# EAGLE schematic recco-rig (EAGLE 9.6.1)
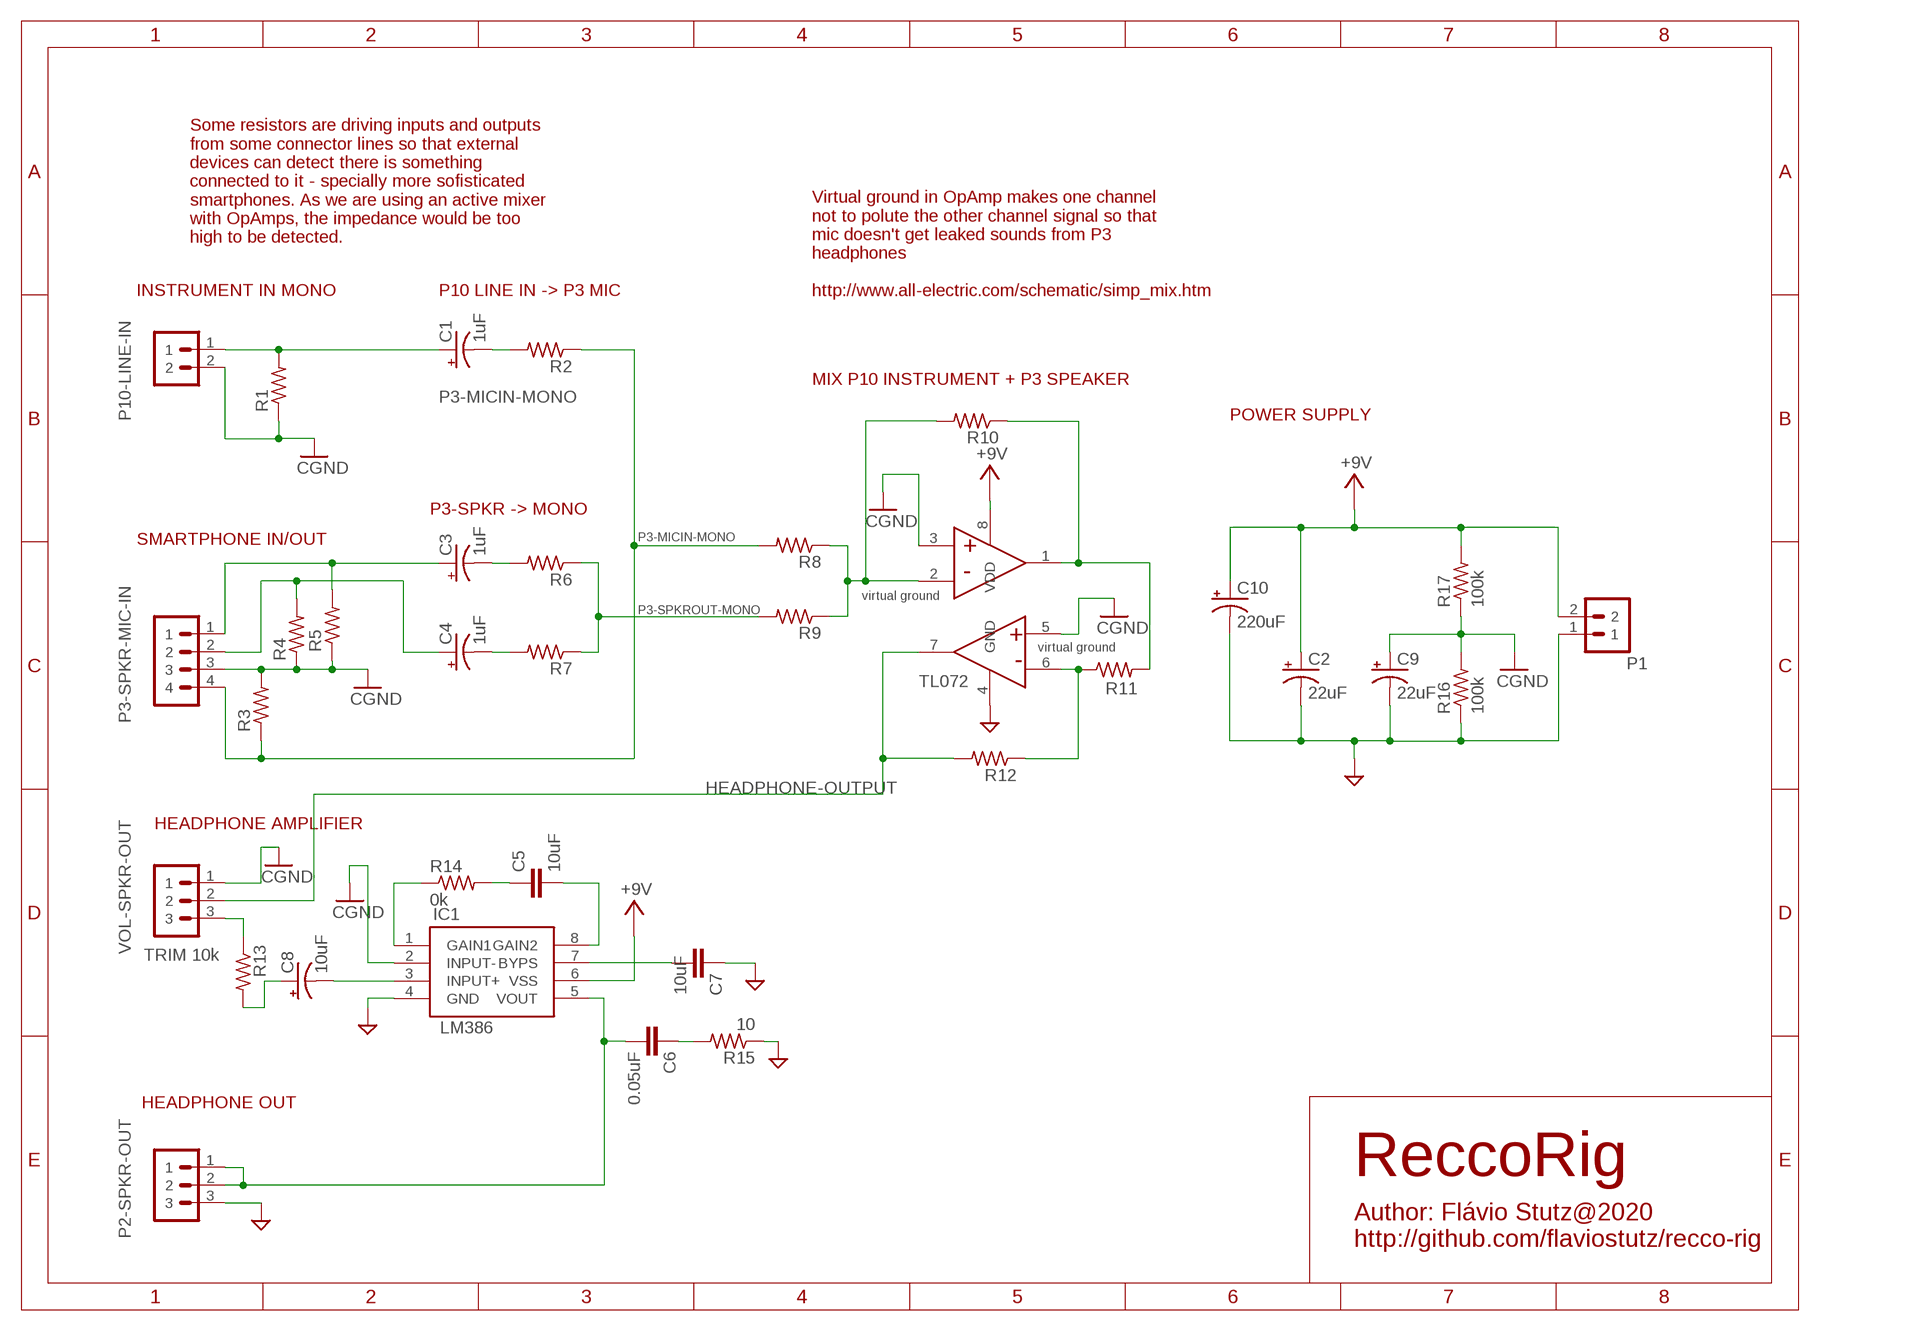
[diagram p0: schematic, sheet 1]

## Parts
C1  1uF  CPOL-USE2,5-6E  [E2,5-6E]
C2  22uF  CPOL-USE2,5-6E  [E2,5-6E]
C3  1uF  CPOL-USE2,5-6E  [E2,5-6E]
C4  1uF  CPOL-USE2,5-6E  [E2,5-6E]
C5  10uF  C-EU050-024X044  [C050-024X044]
C6  0.05uF  C-EU050-024X044  [C050-024X044]
C7  10uF  C-EU050-024X044  [C050-024X044]
C8  10uF  CPOL-USE2,5-6E  [E2,5-6E]
C9  22uF  CPOL-USE2,5-6E  [E2,5-6E]
C10  220uF  CPOL-USE2,5-6E  [E2,5-6E]
IC1  LM386  [PDIP-8PIN]
IC2  TL072-OPAMP  [PDIP-8PIN]
P1  PIN-HEADER-2PIN  [PIN-HEADER-2PIN]
P2-SPKR-OUT  PIN-HEADER-3PIN  [PIN-HEADER-3PIN]
P3-SPKR-MIC-IN  PIN-HEADER-4PIN  [PIN-HEADER-4PIN]
P10-LINE-IN  PIN-HEADER-2PIN  [PIN-HEADER-2PIN]
R1  10k  RESISTORV1  [RESISTOR-V1]
R2  300ohm  RESISTORV1  [RESISTOR-V1]
R3  1k  RESISTORV1  [RESISTOR-V1]
R4  1k  RESISTORV1  [RESISTOR-V1]
R5  1k  RESISTORV1  [RESISTOR-V1]
R6  300ohm  RESISTORV1  [RESISTOR-V1]
R7  300ohm  RESISTORV1  [RESISTOR-V1]
R8  10k  RESISTORV1  [RESISTOR-V1]
R9  10k  RESISTORV1  [RESISTOR-V1]
R10  10k  RESISTORV1  [RESISTOR-V1]
R11  10k  RESISTORV1  [RESISTOR-V1]
R12  10k  RESISTORV1  [RESISTOR-V1]
R13  100ohm  RESISTORV1  [RESISTOR-V1]
R14  0k  R-US_0309/V  [0309V]
R15  10  R-US_0309/V  [0309V]
R16  100k  R-US_0309/V  [0309V]
R17  100k  R-US_0309/V  [0309V]
VOL-SPKR-OUT  HEADPHONE-VOLUME-KNOB  PIN-HEADER-3PIN  [PIN-HEADER-3PIN]

## Nets
+9V: C2.+ C10.+ IC1.6(VSS) IC2.8(VDD) P1.2 R17.2
GND: C2.- C7.1 C9.+ C9.- C10.- IC1.2(INPUT-) IC1.4(GND) IC2.3(1IN+) IC2.4(GND) IC2.5(2IN+) P1.1 P2-SPKR-OUT.3 P3-SPKR-MIC-IN.3 P10-LINE-IN.2 R1.1 R3.2 R4.1 R5.1 R15.1 R16.1 R16.2 R17.1 VOL-SPKR-OUT.1 ; supply symbol labelled CGND
HEADPHONE-OUTPUT: IC2.7(2OUT) R12.2 VOL-SPKR-OUT.2
N$1: C1.- R2.2
N$2: C3.- R6.2
N$3: C4.- R7.2
N$4: IC2.2(1IN-) R8.1 R9.1 R10.2
N$5: IC2.1(1OUT) R10.1 R11.2
N$6: IC2.6(2IN-) R11.1 R12.1
N$7: C6.1 R15.2
N$8: C3.+ P3-SPKR-MIC-IN.1 R5.2
N$10: C8.+ R13.2
N$11: R13.1 VOL-SPKR-OUT.3
N$12: C5.2 IC1.8(GAIN2)
N$13: C5.1 R14.2
N$14: IC1.1(GAIN1) R14.1
N$15: C6.2 IC1.5(VOUT) P2-SPKR-OUT.1 P2-SPKR-OUT.2
N$16: C7.2 IC1.7(BYPS)
N$17: C8.- IC1.3(INPUT+)
P3-MICIN-MONO: P3-SPKR-MIC-IN.4 R2.1 R3.1 R8.2
P3-SPKROUT-MONO: R6.1 R7.1 R9.2
P3-SPKROUT-R: C4.+ P3-SPKR-MIC-IN.2 R4.2
P10-LINEIN-MONO: C1.+ P10-LINE-IN.1 R1.2

## Notes on the sheet
- Some resistors are driving inputs and outputs
  from some connector lines so that external
  devices can detect there is something
  connected to it - specially more sofisticated
  smartphones. As we are using an active mixer
  with OpAmps, the impedance would be too
  high to be detected.
- INSTRUMENT IN MONO | P10 LINE IN -> P3 MIC
- Virtual ground in OpAmp makes one channel
  not to polute the other channel signal so that
  mic doesn't get leaked sounds from P3
  headphones
  
  http://www.all-electric.com/schematic/simp_mix.htm
- MIX P10 INSTRUMENT + P3 SPEAKER
- POWER SUPPLY
- P3-SPKR -> MONO
- SMARTPHONE IN/OUT
- +
- -
- virtual ground
- +
- virtual ground
- -
- TL072
- HEADPHONE AMPLIFIER
- TRIM 10k
- HEADPHONE OUT
- ReccoRig
- Author: Flávio Stutz@2020
  http://github.com/flaviostutz/recco-rig

## Library data of the parts
C1-C4 C8-C10 = rcl:CPOL-US: POLARIZED CAPACITOR, American symbol; SPICEPREFIX: C
C5-C7 = resistor:C-EU: CAPACITOR, European symbol
IC1 = stutz-components-library:LM386
IC2 = stutz-components-library:TL072-OPAMP; SPICEPREFIX: X
P1 P10-LINE-IN = stutz-components-library:PIN-HEADER-2PIN
P2-SPKR-OUT VOL-SPKR-OUT = stutz-components-library:PIN-HEADER-3PIN
P3-SPKR-MIC-IN = stutz-components-library:PIN-HEADER-4PIN
R1-R3 R5-R13 = stutz-components-library:RESISTOR
R4 = stutz-components-library:RESISTOR; SPICEPREFIX: R
R14-R17 = rcl:R-US_: RESISTOR, American symbol; SPICEPREFIX: R